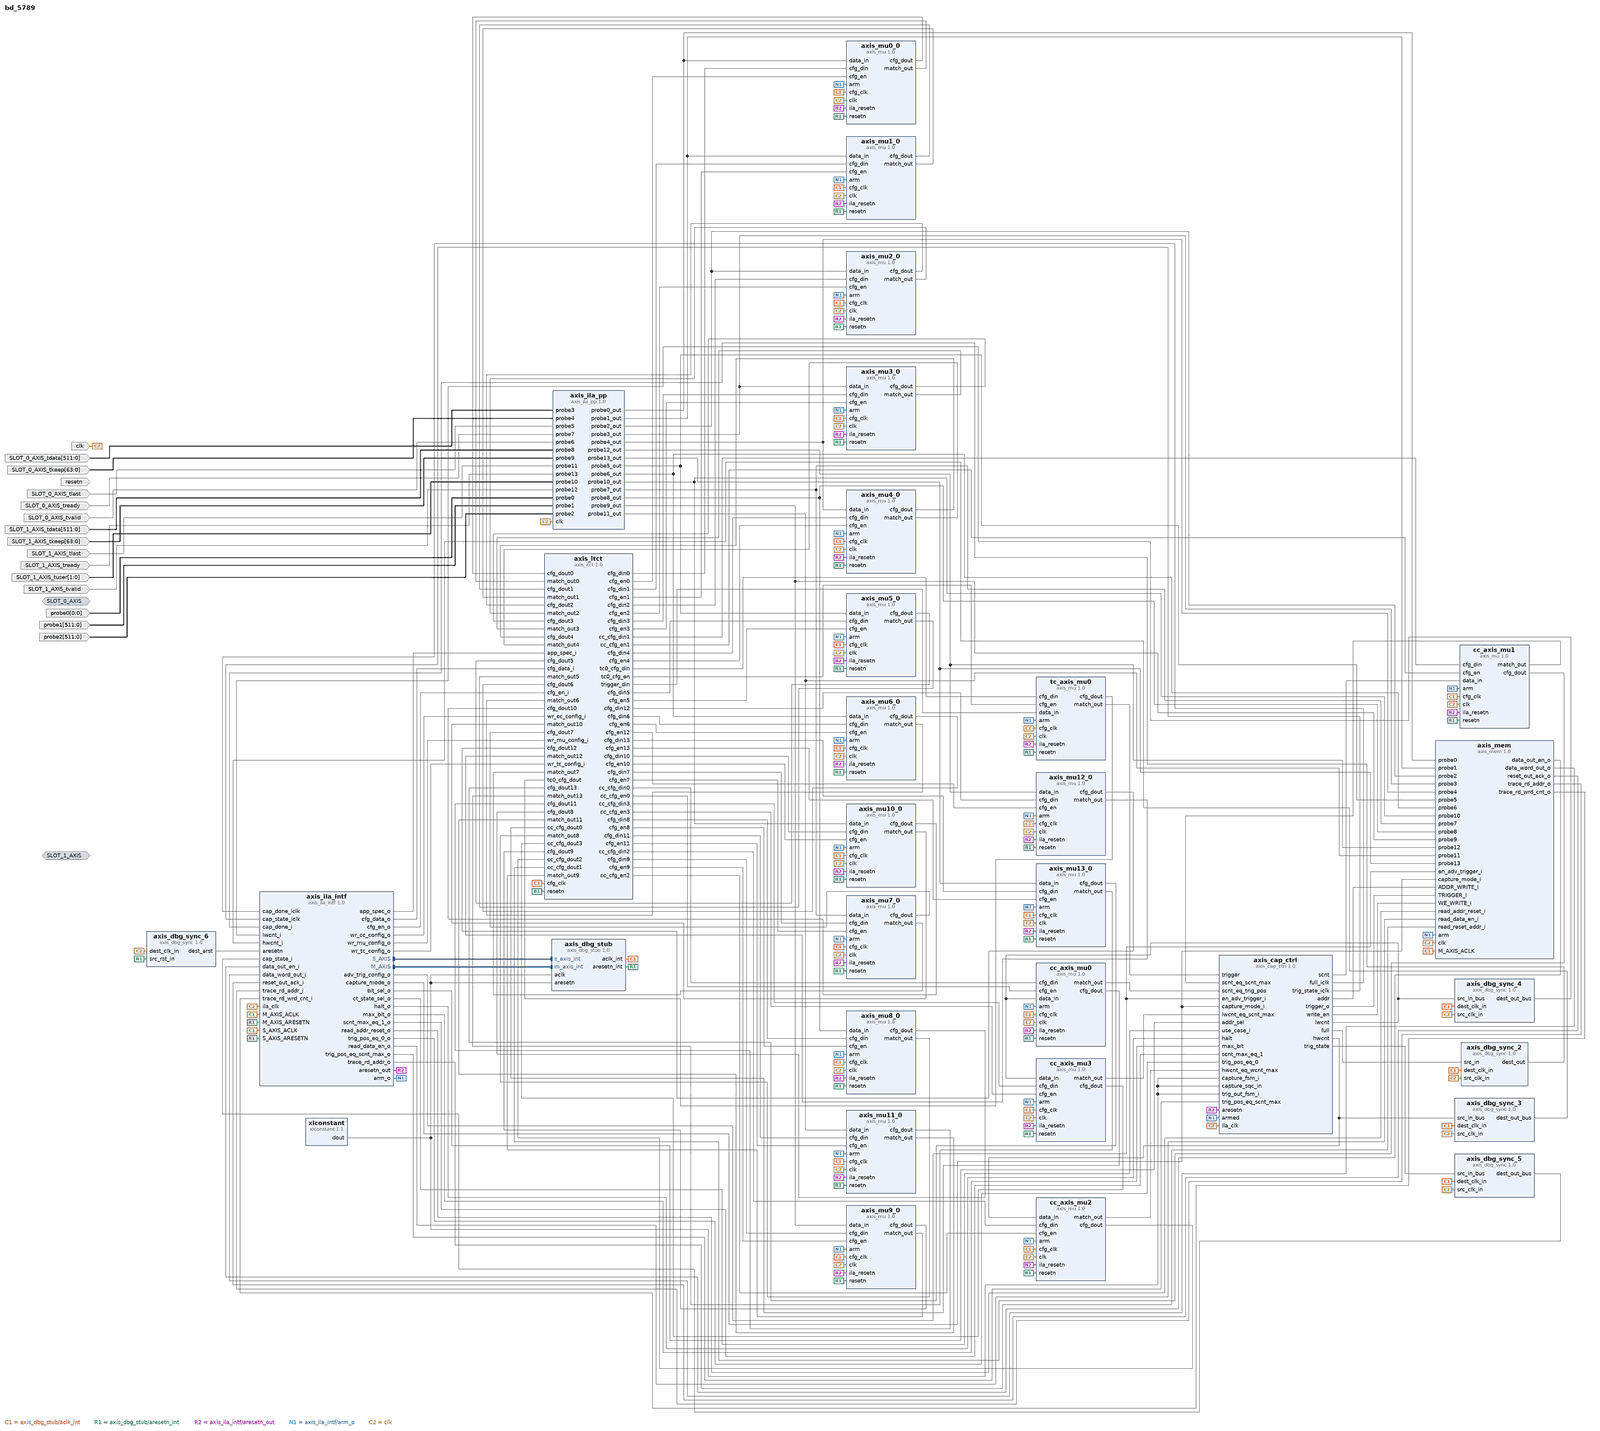
[diagram p0: block diagram of the top level, whole]
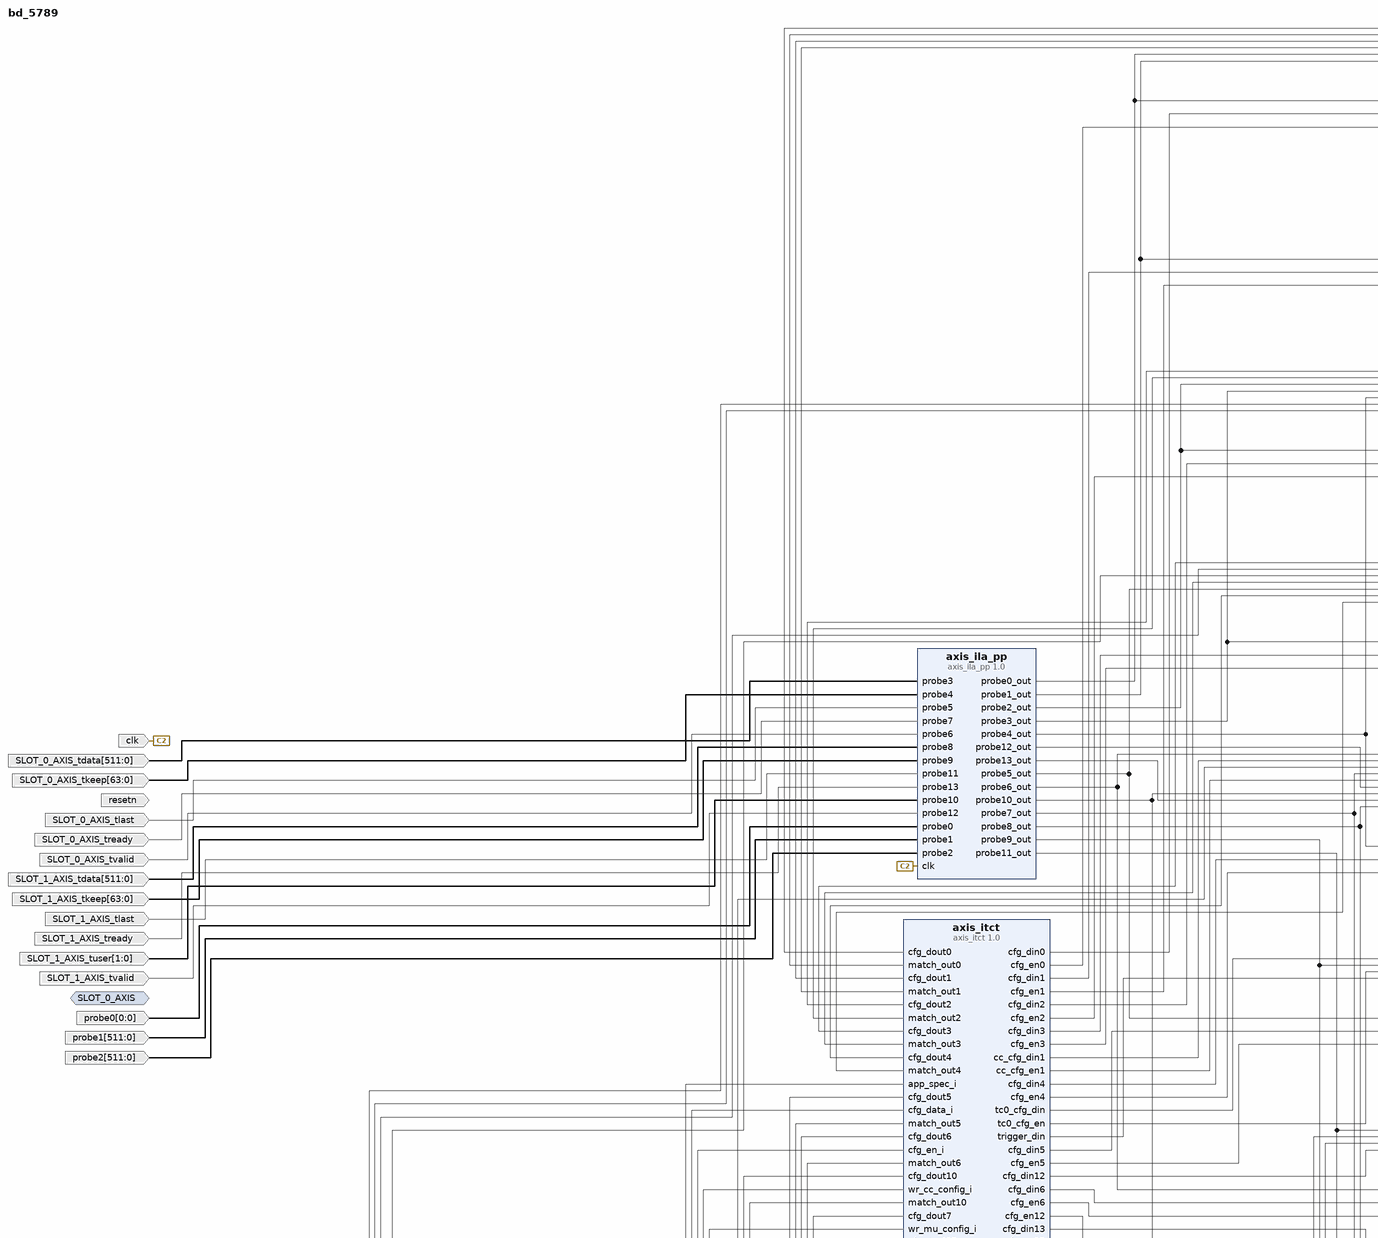
[diagram p1: block diagram of the top level, upper left part]
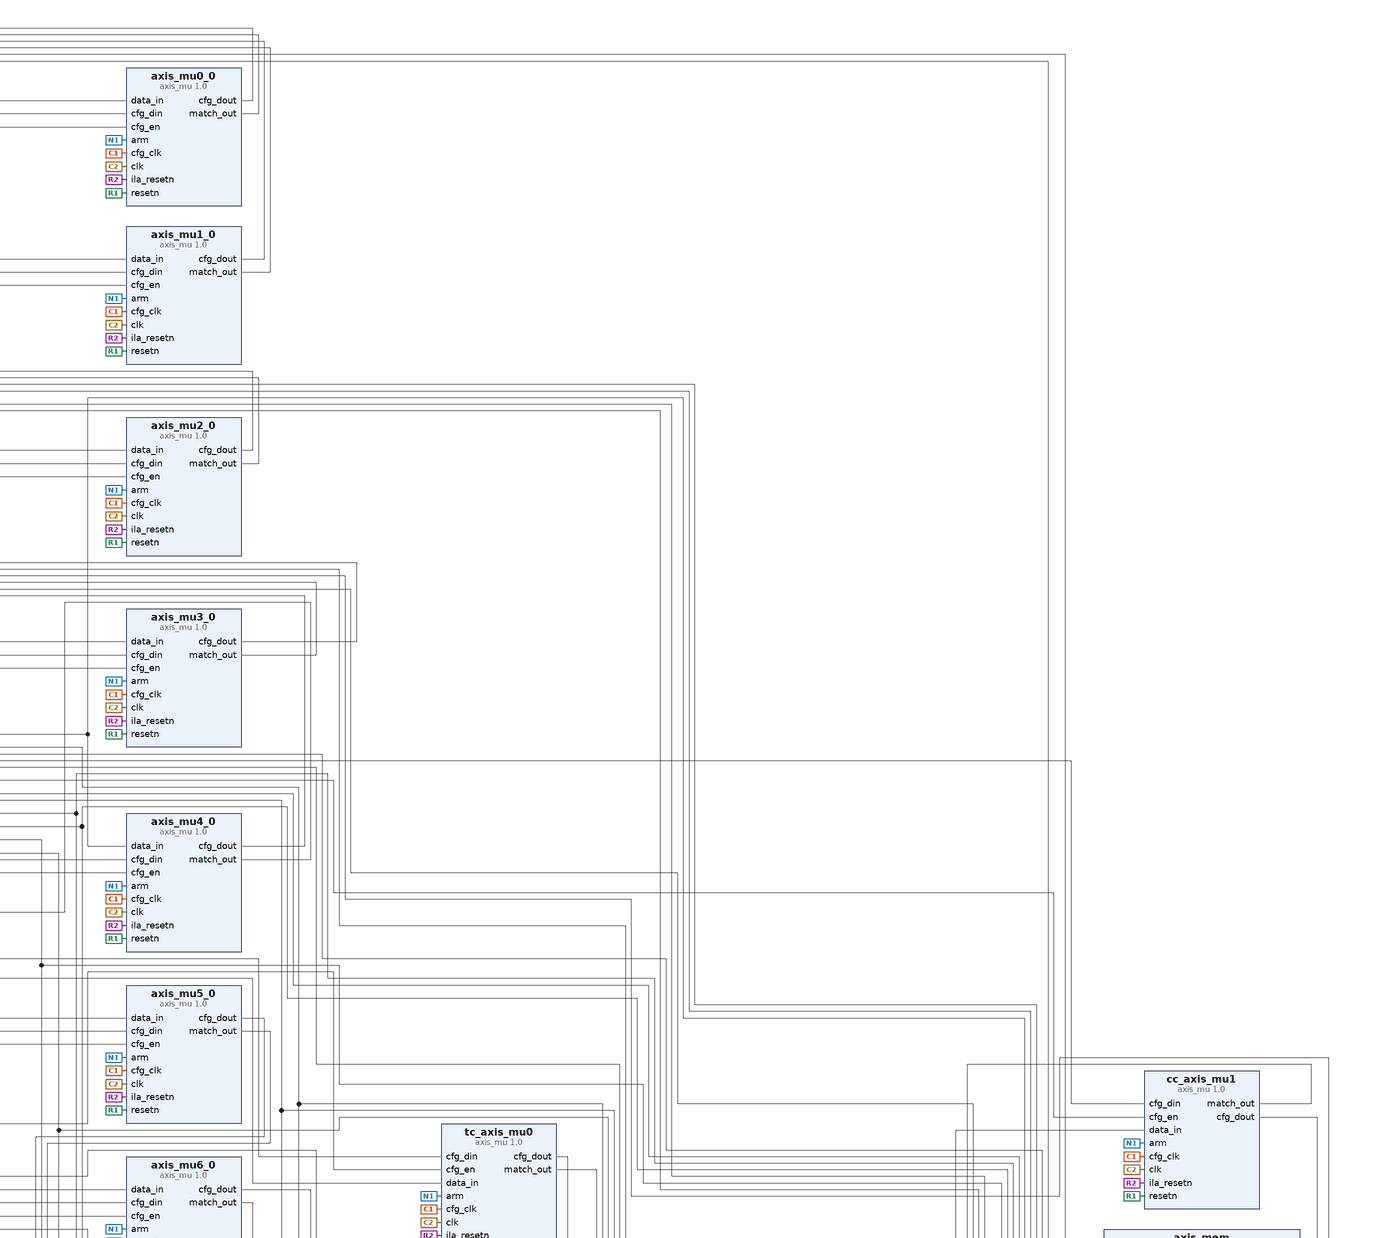
[diagram p2: block diagram of the top level, upper right part]
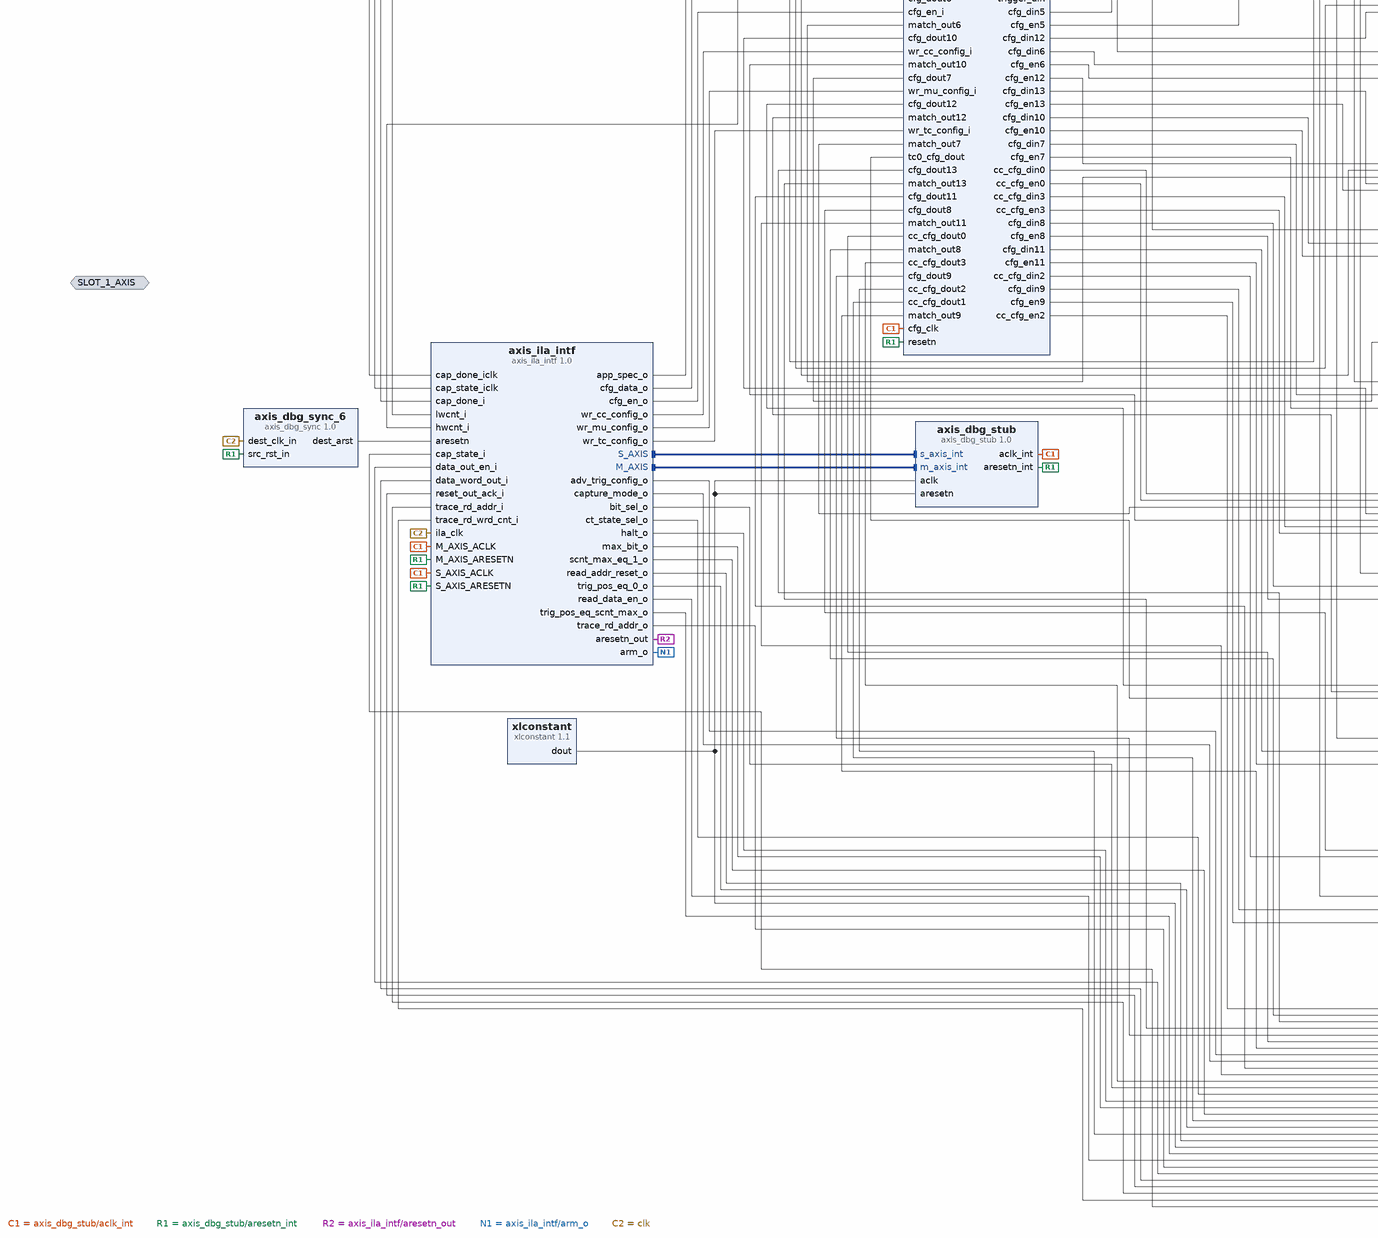
[diagram p3: block diagram of the top level, lower left part]
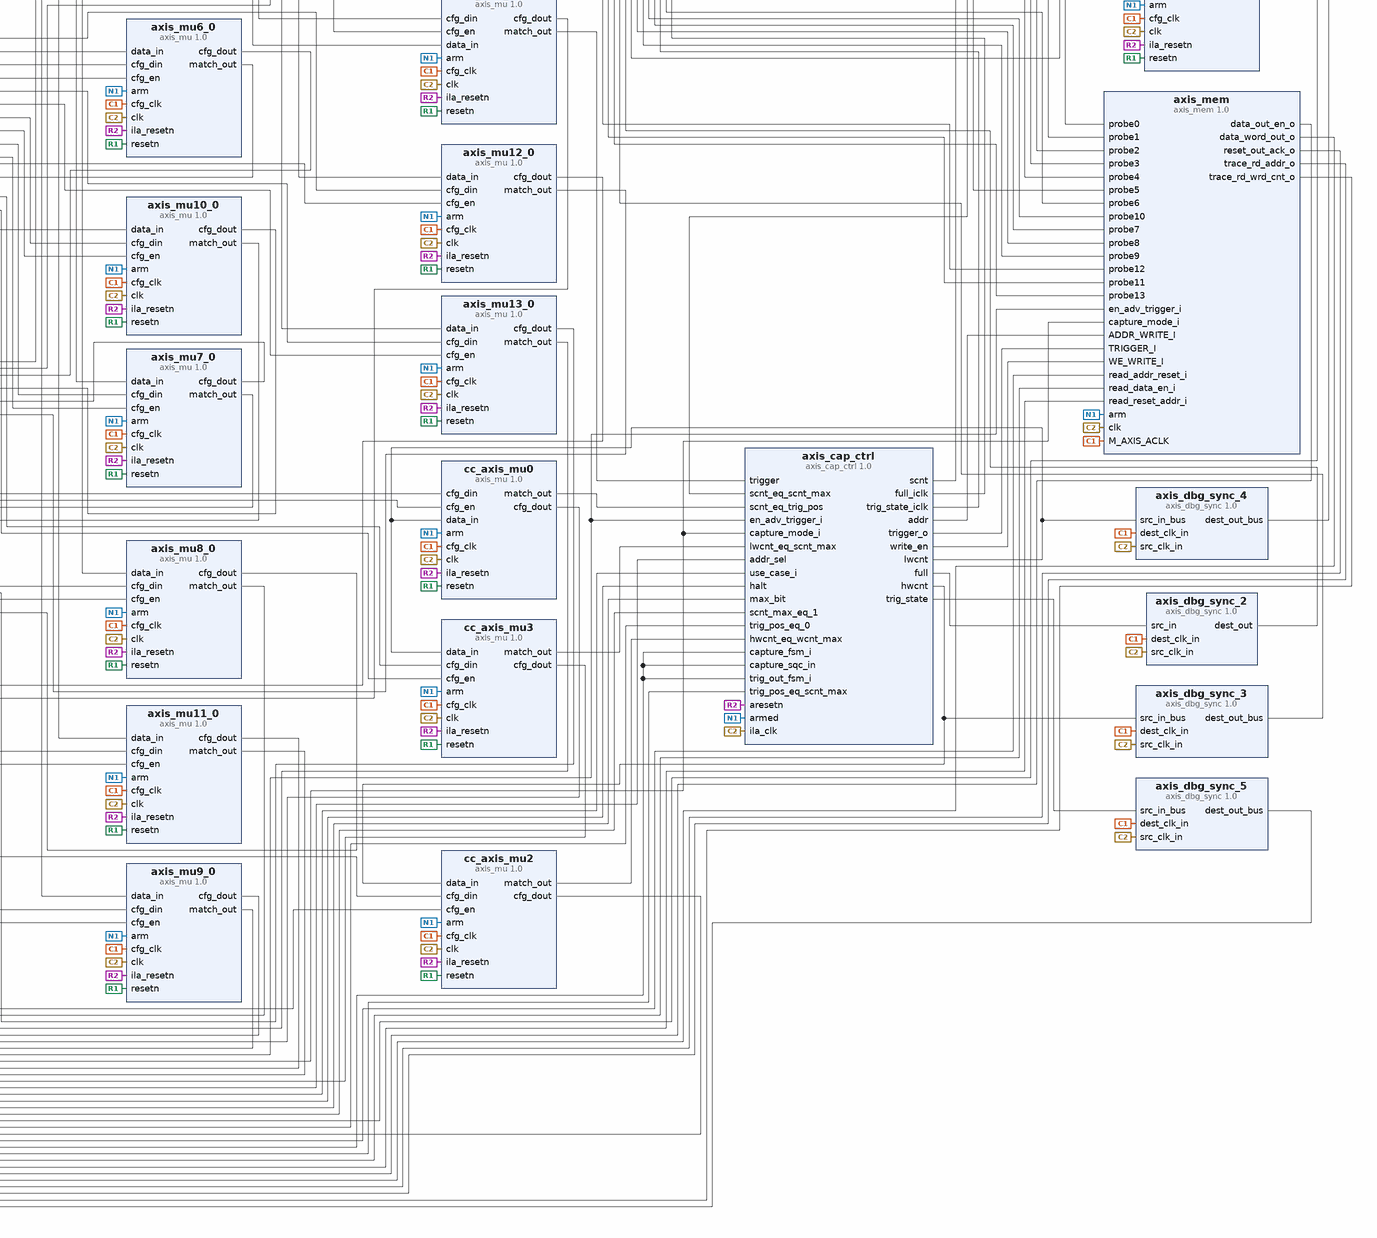
[diagram p4: block diagram of the top level, lower right part]
# Vivado block design bd_5789, xcvp1202-vsva2785-2MP-e-S, Vivado 2024.2
create_bd_design bd_5789

create_bd_intf_port -mode Monitor -vlnv xilinx.com:interface:axis_rtl:1.0 SLOT_0_AXIS
create_bd_intf_port -mode Monitor -vlnv xilinx.com:interface:axis_rtl:1.0 SLOT_1_AXIS
create_bd_port -dir I -type clk clk
set_property -dict {CONFIG.ASSOCIATED_BUSIF SLOT_0_AXIS:SLOT_1_AXIS CONFIG.ASSOCIATED_RESET resetn} [get_bd_ports clk]
create_bd_port -dir I -from 0 -to 0 -type data probe0
create_bd_port -dir I -from 511 -to 0 -type data probe1
create_bd_port -dir I -from 511 -to 0 -type data probe2
create_bd_port -dir I -type rst resetn
create_bd_port -dir I -from 511 -to 0 SLOT_0_AXIS_tdata
create_bd_port -dir I -from 63 -to 0 SLOT_0_AXIS_tkeep
create_bd_port -dir I SLOT_0_AXIS_tlast
create_bd_port -dir I SLOT_0_AXIS_tvalid
create_bd_port -dir I SLOT_0_AXIS_tready
create_bd_port -dir I -from 511 -to 0 SLOT_1_AXIS_tdata
create_bd_port -dir I -from 63 -to 0 SLOT_1_AXIS_tkeep
create_bd_port -dir I SLOT_1_AXIS_tlast
create_bd_port -dir I -from 1 -to 0 SLOT_1_AXIS_tuser
create_bd_port -dir I SLOT_1_AXIS_tvalid
create_bd_port -dir I SLOT_1_AXIS_tready

create_bd_cell -type ip -vlnv xilinx.com:ip:axis_dbg_stub:1.0 axis_dbg_stub
set_property -dict {CONFIG.C_AXIS_DATA_WIDTH 32} [get_bd_cells axis_dbg_stub]
create_bd_cell -type ip -vlnv xilinx.com:ip:xlconstant:1.1 xlconstant
set_property -dict {CONFIG.CONST_VAL 0} [get_bd_cells xlconstant]
create_bd_cell -type ip -vlnv xilinx.com:ip:axis_ila_intf:1.0 axis_ila_intf
